# Altium schematic sheet Top_level.SchDoc
size 381 x 241 mm
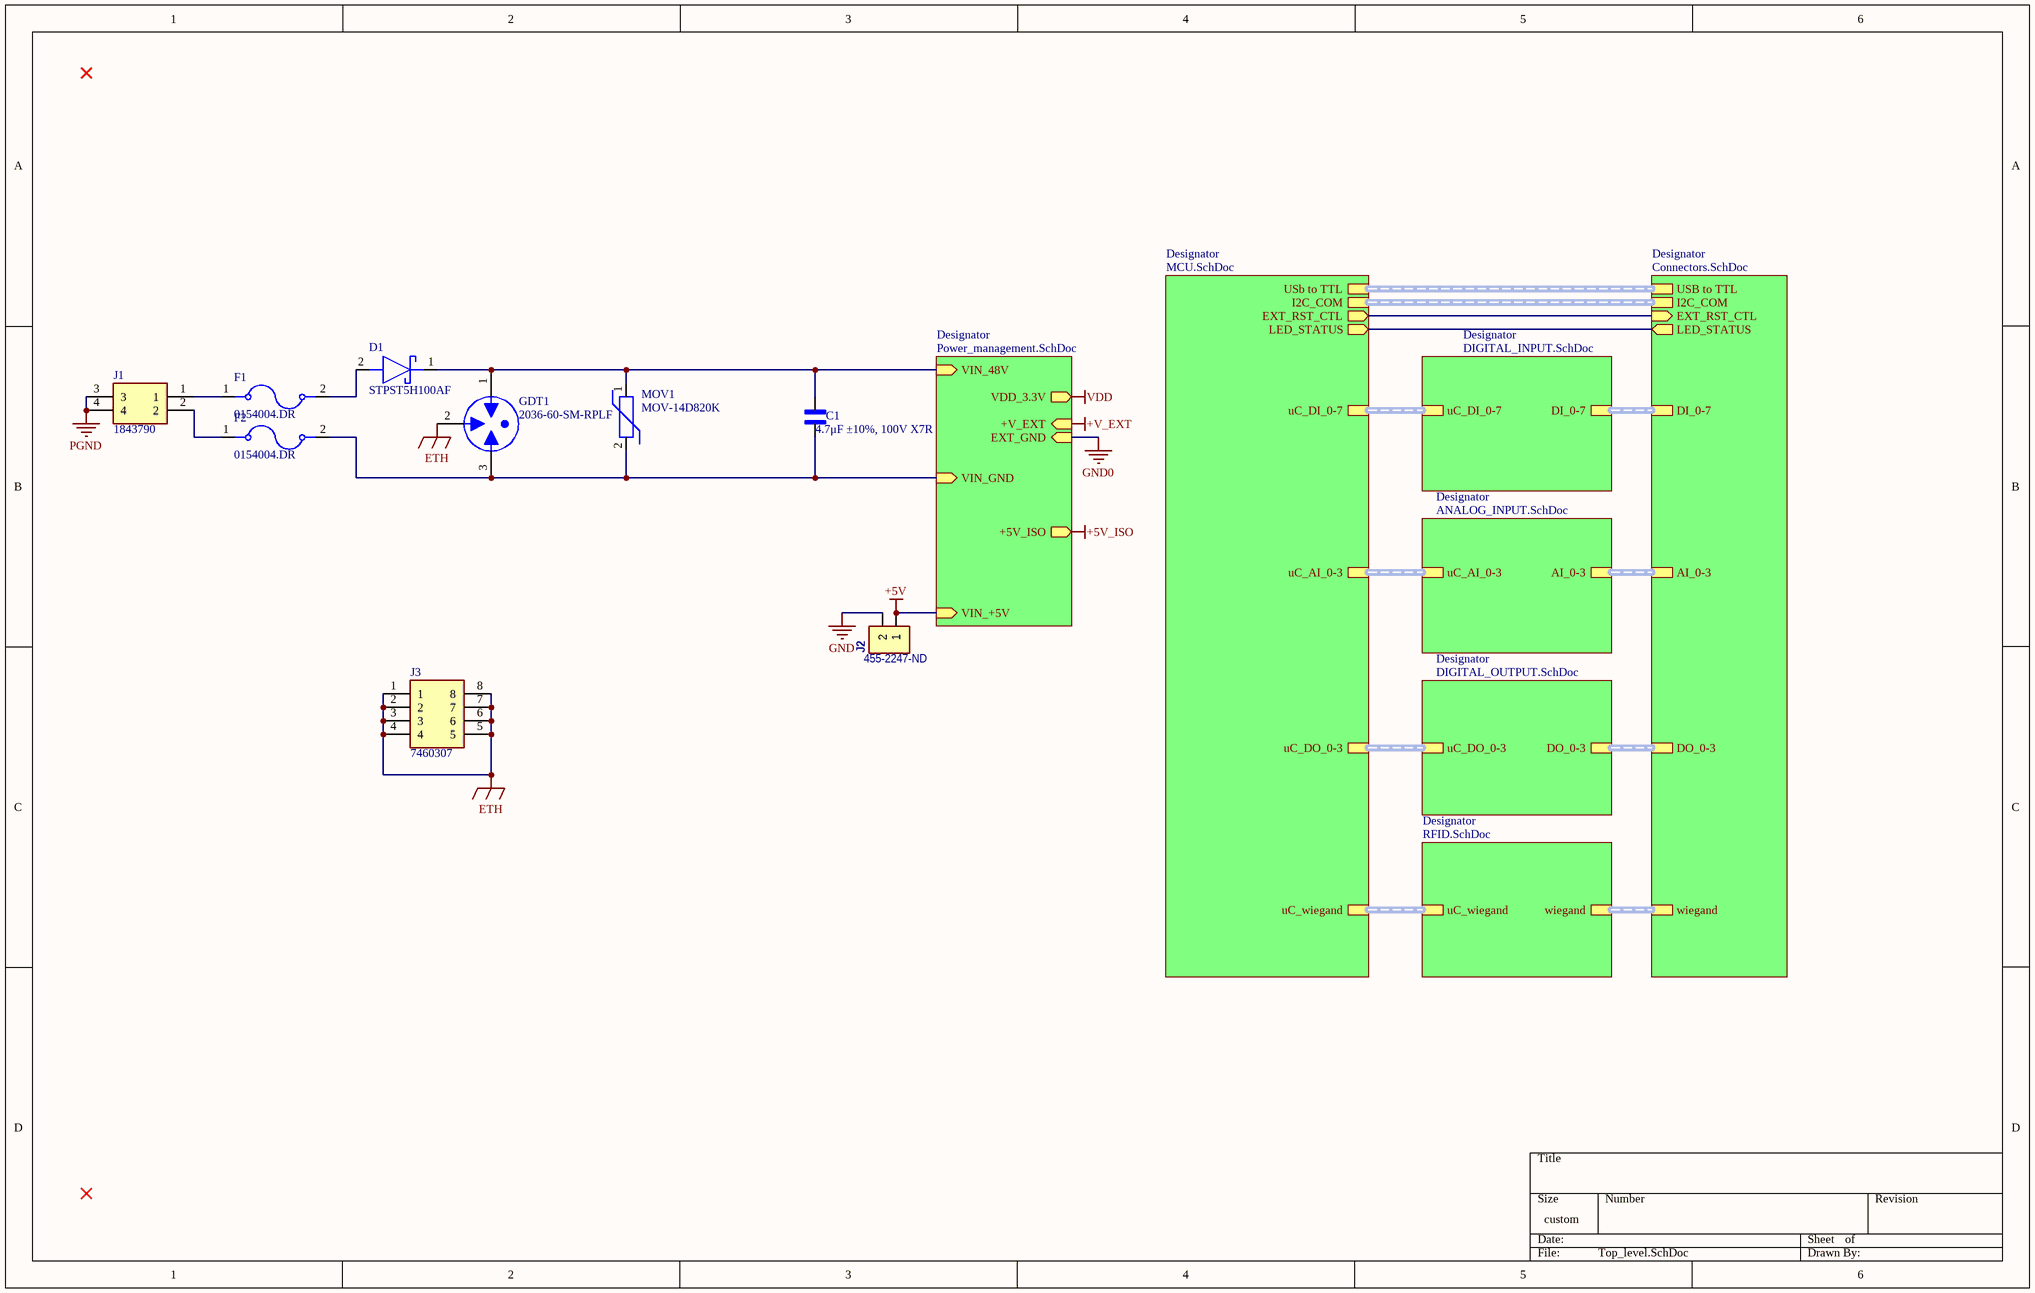
[diagram p0: Top_level.SchDoc]

## Parts
C1  4.7μF ±10%, 100V X7R  [1210_C]
D1  STPST5H100AF  [SODFL4724X103N]
F1  0154004.DR  [FUSE_0154004.DR]
F2  0154004.DR  [FUSE_0154004.DR]
GDT1  2036-60-SM-RPLF  [2036-60-SM-RPLF]
J1  1843790  [1843790]
J2  455-2247-ND  [CON_HDR1x2]
J3  7460307  [7460307]
MOV1  MOV-14D820K  [MOV-14D820K]

## Sub-sheets
Designator = Power_management.SchDoc: VDD_3.3V (out), VIN_48V (in), VIN_GND (in), +V_EXT (in), EXT_GND (in), +5V_ISO (out), VIN_+5V (in)
Designator = MCU.SchDoc: USb to TTL (harness USB to TTL), uC_DI_0-7 (harness uC_DI_0-7), uC_AI_0-3 (harness uC_AI_0-3), uC_DO_0-3 (harness uC_DO_0-3), uC_wiegand (harness uC_wiegand), EXT_RST_CTL (out), I2C_COM (harness I2C_COM), LED_STATUS (out)
Designator = DIGITAL_INPUT.SchDoc: DI_0-7 (harness DI_0-7), uC_DI_0-7 (harness uC_DI_0-7)
Designator = ANALOG_INPUT.SchDoc: AI_0-3 (harness AI_0-3), uC_AI_0-3 (harness uC_AI_0-3)
Designator = Connectors.SchDoc: USB to TTL (harness USB to TTL), DI_0-7 (harness DI_0-7), AI_0-3 (harness AI_0-3), DO_0-3 (harness DO_0-3), wiegand (harness wiegand), I2C_COM (harness I2C_COM), EXT_RST_CTL (in), LED_STATUS (out)
Designator = DIGITAL_OUTPUT.SchDoc: DO_0-3 (harness DO_0-3), uC_DO_0-3 (harness uC_DO_0-3)
Designator = RFID.SchDoc: uC_wiegand (harness uC_wiegand), wiegand (harness wiegand)

## Nets
+5V: J2.1 ; sheet Designator/VIN_+5V
+5V_ISO: sheet Designator/+5V_ISO
+V_EXT: sheet Designator/+V_EXT
ETH: GDT1.2(E) J3.1 J3.2 J3.3 J3.4 J3.5 J3.6 J3.7 J3.8
GND: J2.2
GND0: sheet Designator/EXT_GND
PGND: J1.3 J1.4
VDD: sheet Designator/VDD_3.3V
NetC1_1: C1.1 D1.1(K) GDT1.1(A) MOV1.1 ; sheet Designator/VIN_48V
NetC1_2: C1.2 F2.2 GDT1.3(B) MOV1.2 ; sheet Designator/VIN_GND
NetD1_2: D1.2(A) F1.2
NetF1_1: F1.1 J1.1
NetF2_1: F2.1 J1.2
(unnamed): sheet Designator/EXT_RST_CTL, sheet Designator/EXT_RST_CTL
(unnamed): sheet Designator/LED_STATUS, sheet Designator/LED_STATUS

## Buses and harness runs
harness sheet Designator/USb to TTL = sheet Designator/USB to TTL

## Library data of the parts
C1 = CAP: MP: LD03ZD475MAB2A; Package: None; Price: None; Value: *; Availability: Unavailable
D1 = STPST5H100AF: Schottky Diode; Manufacturer_Name: STMicroelectronics; Datasheet Link: https://www.st.com/resource/en/datasheet/stpst5h100.pdf; Height: 1.03mm; Manufacturer_Part_Number: STPST5H100AF; Mouser Part Number: 511-STPST5H100AF; Mouser Price/Stock: https://www.mouser.co.uk/ProductDetail/STMicroelectronics/STPST5H100AF?qs=Jm2GQyTW%2Fbg40alT%252BULHUw%3D%3D
F1 F2 = 0154004.DR: 154/154T/154L/154TL Series OMNI-BLOKÂ® Fuse and Holder Assembly; Package: None; Availability: Unavailable; Value: *; MP: 0154004.DR; Price: None
GDT1 = 2036-60-SM-RPLF: Gas Discharge Tubes - GDTs / Gas Plasma Arrestors Sparkover100V/s 600V Miniature 3 Pole
J1 = 1843790: Connector; Manufacturer_Name: Phoenix Contact; Datasheet Link: http://www.phoenixcontact.com/de/produkte/1843790/pdf; Height: 7.4mm; Manufacturer_Part_Number: 1843790; Mouser Part Number: 651-1843790; Mouser Price/Stock: https://www.mouser.co.uk/ProductDetail/Phoenix-Contact/1843790?qs=8BCRtFWWXOSOfz2GfgipZg%3D%3D; Arrow Part Number: 1843790; Arrow Price/Stock: https://www.arrow.com/en/products/1843790/phoenix-contact?region=nac
J2 = CON_HDR1x2: ComponentLink1URL: https://www.jst-mfg.com/product/pdf/eng/eXH.pdf; ComponentLink1Description: Datasheet
J3 = 7460307: Connector; Manufacturer_Name: Wurth Elektronik; Datasheet Link: https://katalog.we-online.com/em/datasheet/7460307.pdf; Height: 7mm; Manufacturer_Part_Number: 7460307; Mouser Part Number: 710-7460307; Mouser Price/Stock: https://www.mouser.co.uk/ProductDetail/Wurth-Elektronik/7460307?qs=lykWx4dhCCG1TLZtVq%252B8cQ%3D%3D
MOV1 = MOV-14D820K: Varistors 82volts 14mm; MP: MOV-14D471K; MF: Bourns; Price: None; SnapEDA_Link: https://www.snapeda.com/parts/MOV-14D471K/Bourns/view-part/?ref=snap; Package: Disc-14 Bourns; Availability: In Stock; Check_prices: https://www.snapeda.com/parts/MOV-14D471K/Bourns/view-part/?ref=eda; Purchase-URL: https://pricing.snapeda.com/search/part/MOV-14D471K/?ref=eda; Value: *